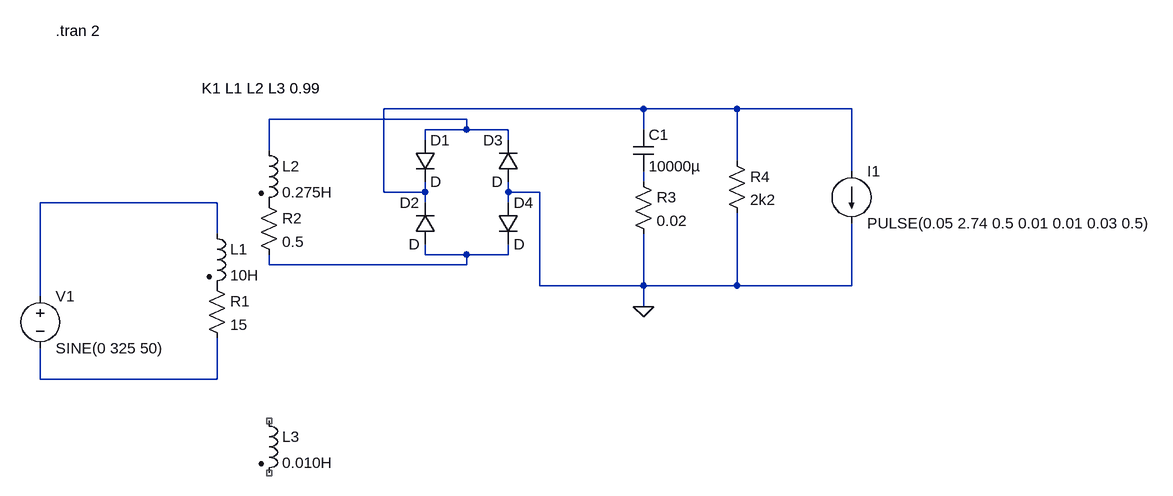
[diagram p0: schematic power_supply_unit.asc]
power_supply_unit.asc, the LTspice schematic file:
Version 4
SHEET 1 1812 680
WIRE 1008 -32 608 -32
WIRE 1152 -32 1008 -32
WIRE 1328 -32 1152 -32
WIRE 736 -16 432 -16
WIRE 736 0 736 -16
WIRE 736 0 672 0
WIRE 800 0 736 0
WIRE 1008 0 1008 -32
WIRE 672 16 672 0
WIRE 800 16 800 0
WIRE 432 32 432 -16
WIRE 1152 48 1152 -32
WIRE 1328 64 1328 -32
WIRE 1008 80 1008 64
WIRE 608 96 608 -32
WIRE 672 96 672 80
WIRE 672 96 608 96
WIRE 800 96 800 80
WIRE 848 96 800 96
WIRE 352 112 80 112
WIRE 672 112 672 96
WIRE 800 112 800 96
WIRE 352 160 352 112
WIRE 672 192 672 176
WIRE 736 192 672 192
WIRE 800 192 800 176
WIRE 800 192 736 192
WIRE 432 208 432 192
WIRE 736 208 736 192
WIRE 736 208 432 208
WIRE 848 240 848 96
WIRE 1008 240 1008 160
WIRE 1008 240 848 240
WIRE 1152 240 1152 128
WIRE 1152 240 1008 240
WIRE 1328 240 1328 144
WIRE 1328 240 1152 240
WIRE 80 256 80 112
WIRE 1008 272 1008 240
WIRE 80 384 80 336
WIRE 352 384 352 320
WIRE 352 384 80 384
FLAG 1008 272 0
SYMBOL voltage 80 240 R0
SYMATTR InstName V1
SYMATTR Value SINE(0 325 50)
SYMBOL ind2 336 144 R0
SYMATTR InstName L1
SYMATTR Value 10H
SYMATTR Type ind
SYMBOL ind2 416 16 R0
SYMATTR InstName L2
SYMATTR Value 0.275H
SYMATTR Type ind
SYMBOL ind2 416 432 R0
SYMATTR InstName L3
SYMATTR Value 0.010H
SYMATTR Type ind
SYMBOL Res 336 224 R0
SYMATTR InstName R1
SYMATTR Value 15
SYMBOL Res 416 96 R0
SYMATTR InstName R2
SYMATTR Value 0.5
SYMBOL Diode 656 16 R0
SYMATTR InstName D1
SYMBOL Diode 688 176 R180
WINDOW 0 24 64 Left 2
WINDOW 3 24 0 Left 2
SYMATTR InstName D2
SYMBOL Diode 816 80 R180
WINDOW 0 24 64 Left 2
WINDOW 3 24 0 Left 2
SYMATTR InstName D3
SYMBOL Diode 784 112 R0
SYMATTR InstName D4
SYMBOL Cap 992 0 R0
SYMATTR InstName C1
SYMATTR Value 10000µ
SYMBOL Res 992 64 R0
SYMATTR InstName R3
SYMATTR Value 0.02
SYMBOL Res 1136 32 R0
SYMATTR InstName R4
SYMATTR Value 2k2
SYMBOL load2 1328 64 R0
SYMATTR InstName I1
SYMATTR Value PULSE(0.05 2.74 0.5 0.01 0.01 0.03 0.5)
TEXT 328 -64 Left 2 !K1 L1 L2 L3 0.99
TEXT 104 -152 Left 2 !.tran 2

The netlist it stands for:
* power_supply_unit.asc
V1 N004 N006 SINE(0 325 50)
L1 N004 P001 10H
L2 N002 P002 0.275H
L3 NC_01 NC_02 0.010H
R1 P001 N006 15
R2 P002 N005 0.5
D1 N002 N001 D
D2 N005 N001 D
D3 0 N002 D
D4 0 N005 D
C1 N001 N003 10000µ
R3 N003 0 0.02
R4 N001 0 2k2
I1 N001 0 PULSE(0.05 2.74 0.5 0.01 0.01 0.03 0.5)
.model D D
.lib standard.dio
K1 L1 L2 L3 0.99
.tran 2
.backanno
.end